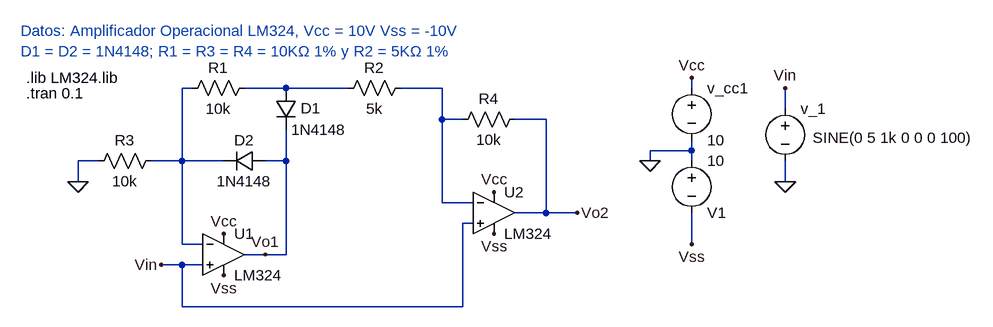
[diagram p0: schematic circuito3lab1.asc]
circuito3lab1.asc, the LTspice schematic file:
Version 4
SHEET 1 1368 680
WIRE 144 128 128 128
WIRE 288 128 224 128
WIRE 384 128 288 128
WIRE 528 128 464 128
WIRE 912 128 912 112
WIRE 1056 160 1056 128
WIRE 528 176 528 128
WIRE 560 176 528 176
WIRE 688 176 640 176
WIRE 912 224 912 208
WIRE 912 224 848 224
WIRE 0 240 -32 240
WIRE 128 240 128 128
WIRE 128 240 80 240
WIRE 192 240 128 240
WIRE 288 240 288 192
WIRE 288 240 256 240
WIRE 848 240 848 224
WIRE 912 240 912 224
WIRE -32 272 -32 240
WIRE 1056 272 1056 240
WIRE 528 304 528 176
WIRE 576 304 528 304
WIRE 688 320 688 176
WIRE 688 320 640 320
WIRE 736 320 688 320
WIRE 576 336 560 336
WIRE 128 368 128 240
WIRE 160 368 128 368
WIRE 912 368 912 320
WIRE 256 384 224 384
WIRE 288 384 288 240
WIRE 288 384 256 384
WIRE 128 400 96 400
WIRE 160 400 128 400
WIRE 128 464 128 400
WIRE 560 464 560 336
WIRE 560 464 128 464
FLAG 192 416 Vss
FLAG 848 240 0
FLAG 1056 272 0
FLAG 912 112 Vcc
FLAG 1056 128 Vin
FLAG 912 368 Vss
FLAG 608 288 Vcc
FLAG 608 352 Vss
FLAG -32 272 0
FLAG 96 400 Vin
FLAG 192 352 Vcc
FLAG 736 320 Vo2
FLAG 256 384 Vo1
SYMBOL OpAmps\\opamp2 192 320 R0
SYMATTR InstName U1
SYMATTR Value LM324
SYMBOL voltage 912 112 R0
WINDOW 123 0 0 Left 0
WINDOW 39 0 0 Left 0
SYMATTR InstName v_cc1
SYMATTR Value 10
SYMBOL voltage 1056 144 R0
WINDOW 3 42 60 Left 2
WINDOW 123 0 0 Left 0
WINDOW 39 0 0 Left 0
SYMATTR Value SINE(0 5 1k 0 0 0 100)
SYMATTR InstName v_1
SYMBOL voltage 912 224 R0
WINDOW 0 24 96 Left 2
WINDOW 3 24 16 Left 2
WINDOW 123 0 0 Left 0
WINDOW 39 0 0 Left 0
SYMATTR InstName V1
SYMATTR Value 10
SYMBOL OpAmps\\opamp2 608 256 R0
SYMATTR InstName U2
SYMATTR Value LM324
SYMBOL res 96 224 R90
WINDOW 0 0 56 VBottom 2
WINDOW 3 32 56 VTop 2
SYMATTR InstName R3
SYMATTR Value 10k
SYMBOL res 240 112 R90
WINDOW 0 0 56 VBottom 2
WINDOW 3 32 56 VTop 2
SYMATTR InstName R1
SYMATTR Value 10k
SYMBOL res 480 112 R90
WINDOW 0 0 56 VBottom 2
WINDOW 3 32 56 VTop 2
SYMATTR InstName R2
SYMATTR Value 5k
SYMBOL res 656 160 R90
WINDOW 0 0 56 VBottom 2
WINDOW 3 32 56 VTop 2
SYMATTR InstName R4
SYMATTR Value 10k
SYMBOL diode 272 128 R0
WINDOW 0 39 31 Left 2
SYMATTR InstName D1
SYMATTR Value 1N4148
SYMBOL diode 256 224 R90
WINDOW 0 0 32 VBottom 2
WINDOW 3 32 32 VTop 2
SYMATTR InstName D2
SYMATTR Value 1N4148
TEXT -120 40 Left 2 ;Datos: Amplificador Operacional LM324, Vcc = 10V Vss = -10V \nD1 = D2 = 1N4148; R1 = R3 = R4 = 10KΩ 1% y R2 = 5KΩ 1%
TEXT -112 112 Left 2 !.lib LM324.lib
TEXT -112 136 Left 2 !.tran 0.1

The netlist it stands for:
* circuito3lab1.asc
XU1 Vin N001 Vcc Vss Vo1 LM324  ; pins In+ In- V+ V- OUT
v_cc1 Vcc 0 10
v_1 Vin 0 SINE(0 5 1k 0 0 0 100)
V1 0 Vss 10
XU2 Vin N003 Vcc Vss Vo2 LM324  ; pins In+ In- V+ V- OUT
R3 N001 0 10k
R1 N002 N001 10k
R2 N003 N002 5k
R4 Vo2 N003 10k
D1 N002 Vo1 1N4148
D2 Vo1 N001 1N4148
.model D D
.lib standard.dio
* Datos: Amplificador Operacional LM324, Vcc = 10V Vss = -10V
* D1 = D2 = 1N4148; R1 = R3 = R4 = 10KΩ 1% y R2 = 5KΩ 1%
.lib LM324.lib
.tran 0.1
.backanno
.end